# Altium schematic sheet coils.SchDoc
size A
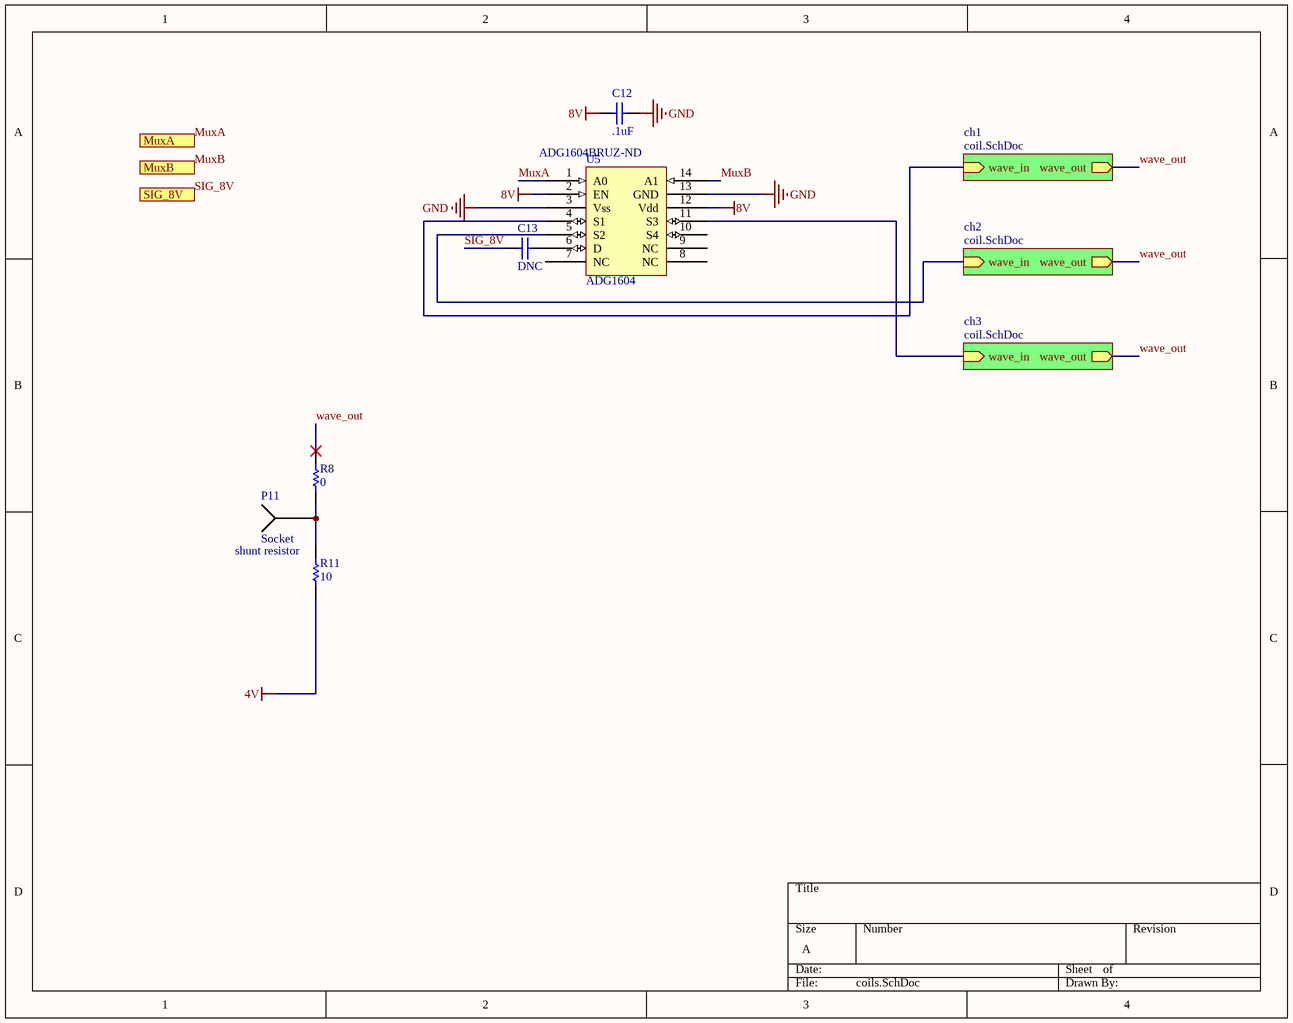
[diagram p0: coils.SchDoc]

## Parts
C12  value .1uF  [0603]  (hidden comment: Cap)
C13  value DNC  [0603]  (hidden comment: Cap)
P11  Socket  [socket]
R8  value 0  [0603]  (hidden comment: Res)
R11  value 10  [0603]  (hidden comment: Res)
U5  ADG1604  Supplier Part Number 1: ADG1604BRUZ-ND  [TSSOP-14]

## Sub-sheets
ch1 = coil.SchDoc: wave_in (in), wave_out (out)
ch2 = coil.SchDoc: wave_in (in), wave_out (out)
ch3 = coil.SchDoc: wave_in (in), wave_out (out)

## Ports
MuxA (in), MuxB (in), SIG_8V (in)

## Nets
4V: R11.1
8V: C12.1 U5.2(EN) U5.12(Vdd)
GND: C12.2 U5.3(Vss) U5.13(GND)
MuxA: U5.1(A0) ; port MuxA
MuxB: U5.14(A1) ; port MuxB
SIG_8V: C13.1 ; port SIG_8V
wave_out: R8.2 ; sheet ch1/wave_out, sheet ch2/wave_out, sheet ch3/wave_out
NetC13_2: C13.2 U5.6(D)
NetP11_0: P11.0 R8.1 R11.2
NetU5_4: U5.4(S1) ; sheet ch1/wave_in
NetU5_5: U5.5(S2) ; sheet ch2/wave_in
NetU5_11: U5.11(S3) ; sheet ch3/wave_in

Not connected (* = marked no-connect by the designer): U5 7(NC) 8(NC) 9(NC) 10(S4)

## Notes on the sheet
- (near R11) shunt resistor

## Library data of the parts
C12 C13 = Cap: Ceramic Capacitor (Surface Mount); Manufacturer: Generic Ceramic Chip Cap (TBD); Digi-Key Part Number: *; Manufacturer Part Number: *; Note: *; Rating: *
R8 R11 = Res: Chip Resistor (Surface Mount); Manufacturer: Generic Chip Res (TBD); Manufacturer Part Number: *; Digi-Key Part Number: *; Rating: *
U5 = ADG1604: Supplier 1: Digi-Key